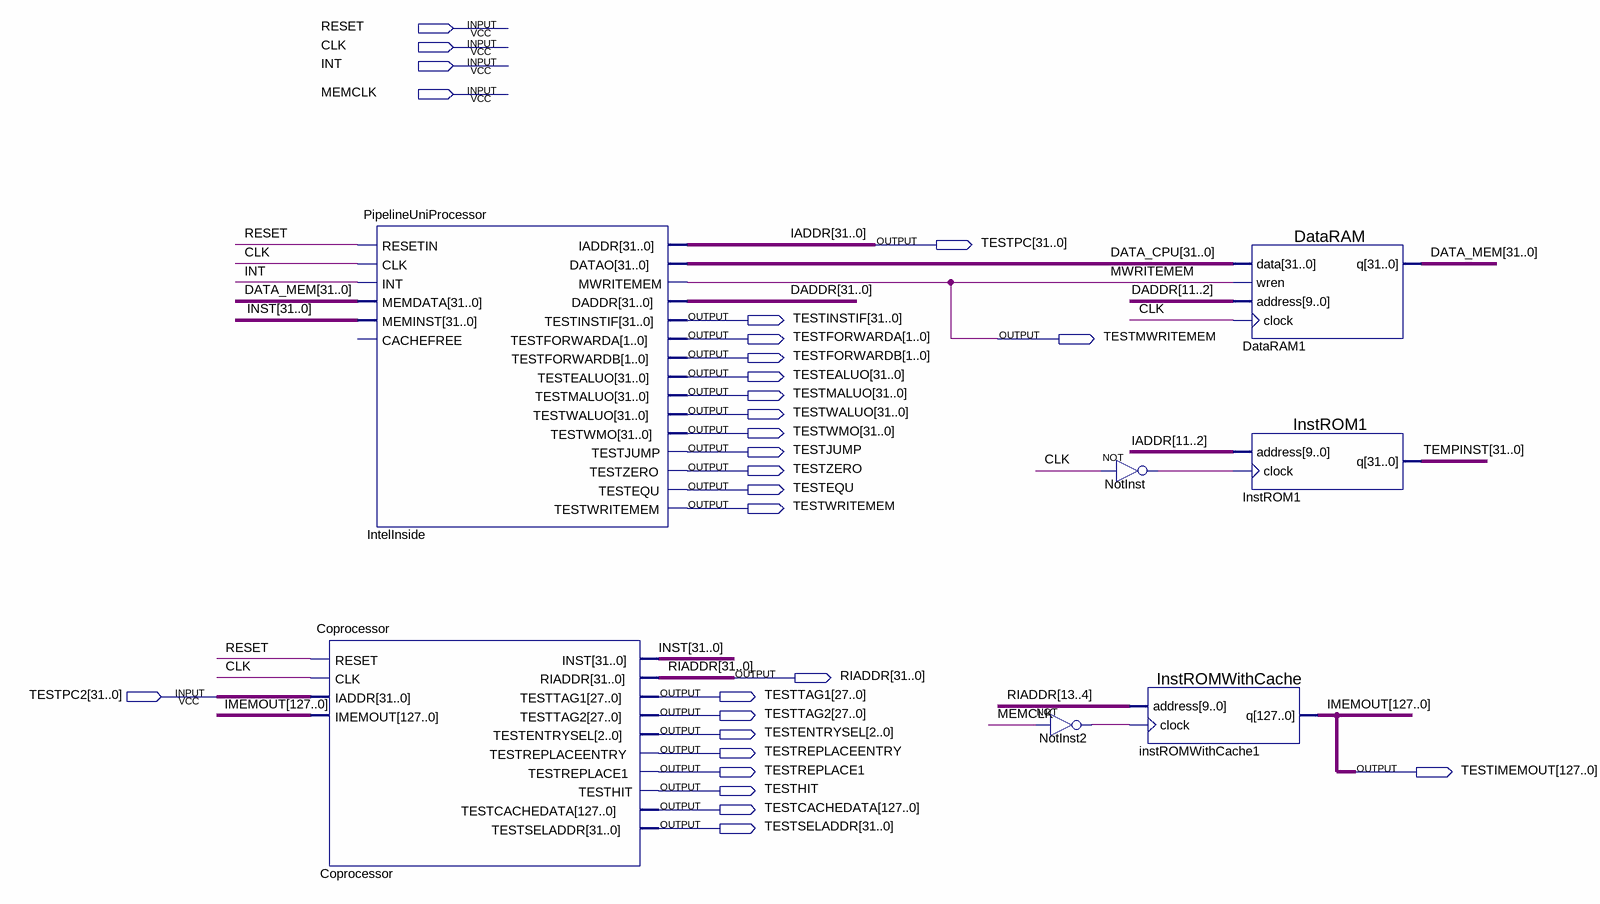
[diagram p0: schematic sheet]
// Quartus schematic MotherBoard.bdf as structural Verilog: 7 symbols, 28 pins
module MotherBoard (
  input  RESET,
  input  CLK,
  input  INT,
  input  MEMCLK,
  input  [31:0] TESTPC2,
  output [31:0] TESTPC,
  output [31:0] TESTINSTIF,
  output [1:0] TESTFORWARDA,
  output TESTMWRITEMEM,
  output [1:0] TESTFORWARDB,
  output [31:0] TESTEALUO,
  output [31:0] TESTMALUO,
  output [31:0] TESTWALUO,
  output [31:0] TESTWMO,
  output TESTJUMP,
  output TESTZERO,
  output TESTEQU,
  output TESTWRITEMEM,
  output [31:0] RIADDR,
  output [27:0] TESTTAG1,
  output [27:0] TESTTAG2,
  output [2:0] TESTENTRYSEL,
  output TESTREPLACEENTRY,
  output TESTREPLACE1,
  output [127:0] TESTIMEMOUT,
  output TESTHIT,
  output [127:0] TESTCACHEDATA,
  output [31:0] TESTSELADDR
);

  wire NotInst2_out, NotInst_out;
  wire [31:0] DADDR, DATA_CPU, DATA_MEM, INST, TEMPINST;

  Coprocessor Coprocessor (
    .RESET(RESET), .CLK(CLK), .IADDR(TESTPC2), .IMEMOUT(TESTIMEMOUT), .INST(INST), .RIADDR(RIADDR),
    .TESTTAG1(TESTTAG1), .TESTTAG2(TESTTAG2), .TESTENTRYSEL(TESTENTRYSEL),
    .TESTREPLACEENTRY(TESTREPLACEENTRY), .TESTREPLACE1(TESTREPLACE1), .TESTHIT(TESTHIT),
    .TESTCACHEDATA(TESTCACHEDATA), .TESTSELADDR(TESTSELADDR));
  PipelineUniProcessor IntelInside (
    .RESETIN(RESET), .CLK(CLK), .INT(INT), .MEMDATA(DATA_MEM), .MEMINST(INST), .IADDR(TESTPC),
    .DATAO(DATA_CPU), .MWRITEMEM(TESTMWRITEMEM), .DADDR(DADDR), .TESTINSTIF(TESTINSTIF),
    .TESTFORWARDA(TESTFORWARDA), .TESTFORWARDB(TESTFORWARDB), .TESTEALUO(TESTEALUO), .TESTMALUO(TESTMALUO),
    .TESTWALUO(TESTWALUO), .TESTWMO(TESTWMO), .TESTJUMP(TESTJUMP), .TESTZERO(TESTZERO), .TESTEQU(TESTEQU),
    .TESTWRITEMEM(TESTWRITEMEM));  // open: CACHEFREE
  not NotInst2 (NotInst2_out, MEMCLK);
  not NotInst (NotInst_out, CLK);
  InstROMWithCache instROMWithCache1 (.address(RIADDR[13:4]), .clock(NotInst2_out), .q(TESTIMEMOUT));
  DataRAM DataRAM1 (.data(DATA_CPU), .wren(TESTMWRITEMEM), .address(DADDR[11:2]), .clock(CLK), .q(DATA_MEM));
  InstROM1 InstROM1 (.address(TESTPC[11:2]), .clock(NotInst_out), .q(TEMPINST));

  // Other names for the same wires on the sheet: IADDR[31:0] = TESTPC; IMEMOUT[127:0] = TESTIMEMOUT;
  //   MWRITEMEM = TESTMWRITEMEM
endmodule
